# Altium schematic sheet 3Phase Inverter1.SchDoc
size A2
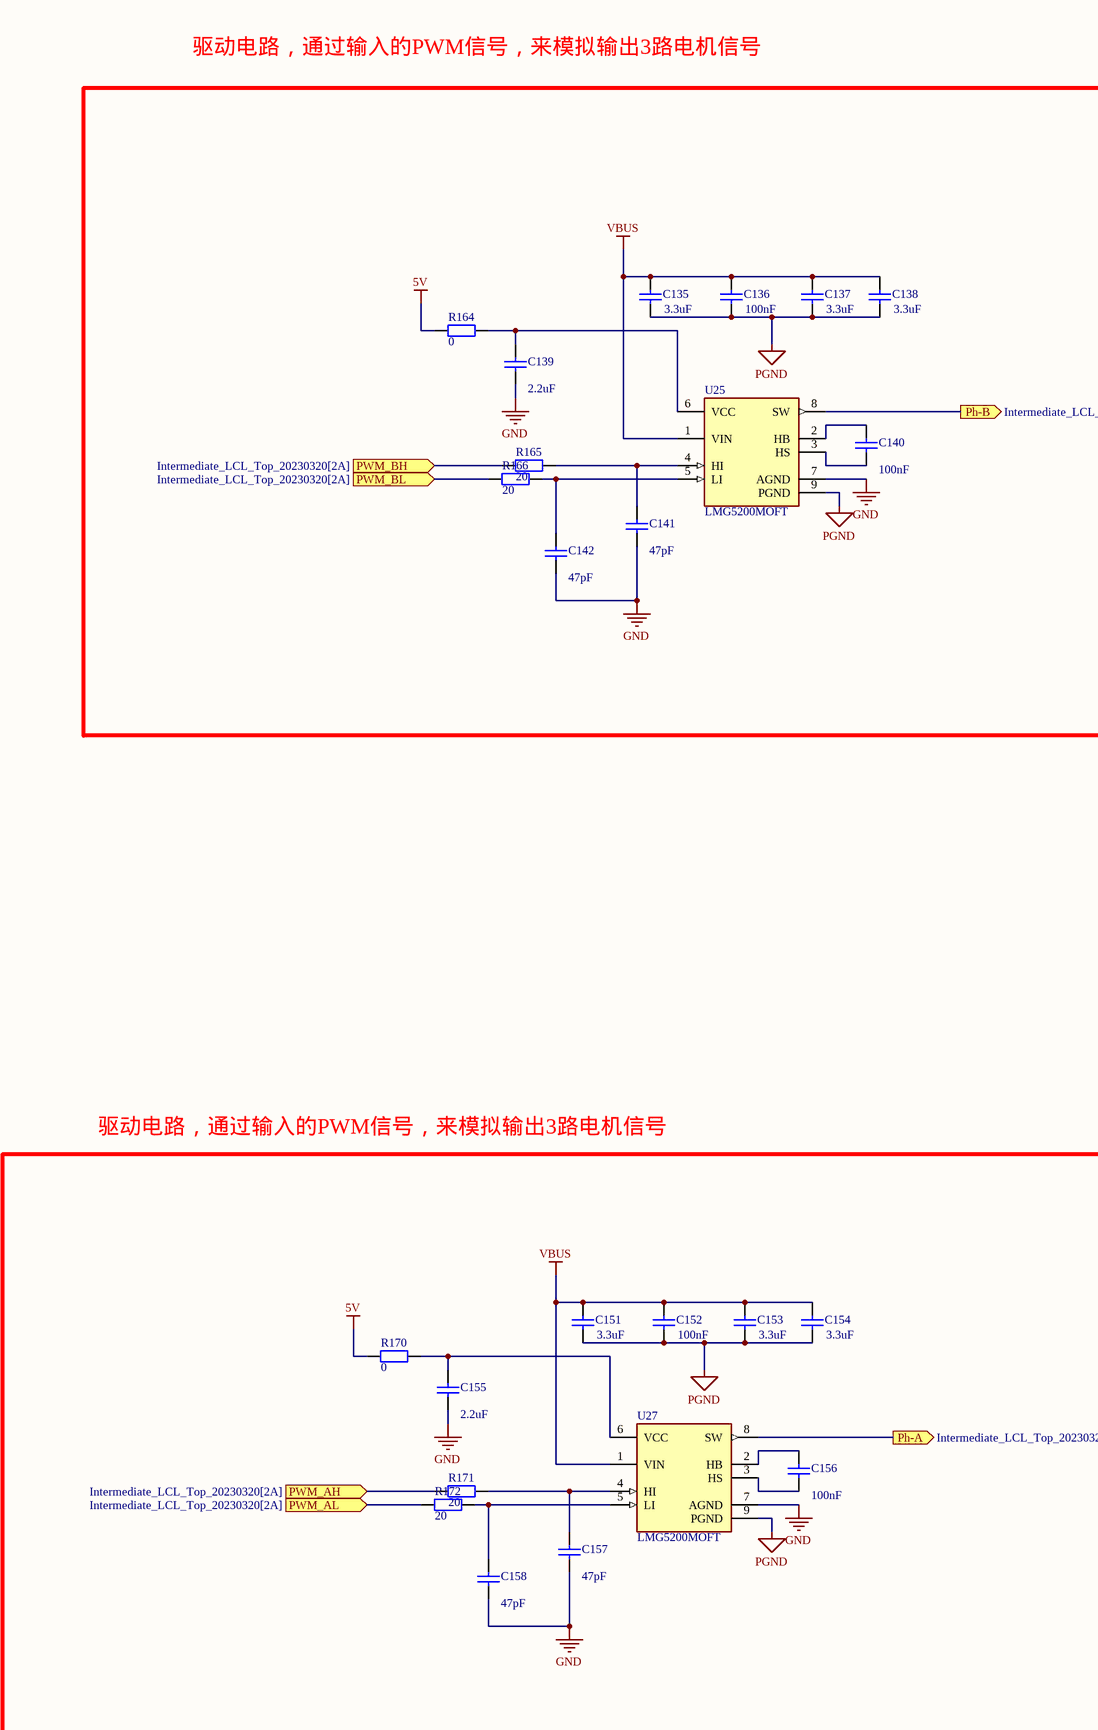
[diagram p0: 3Phase Inverter1.SchDoc, left]
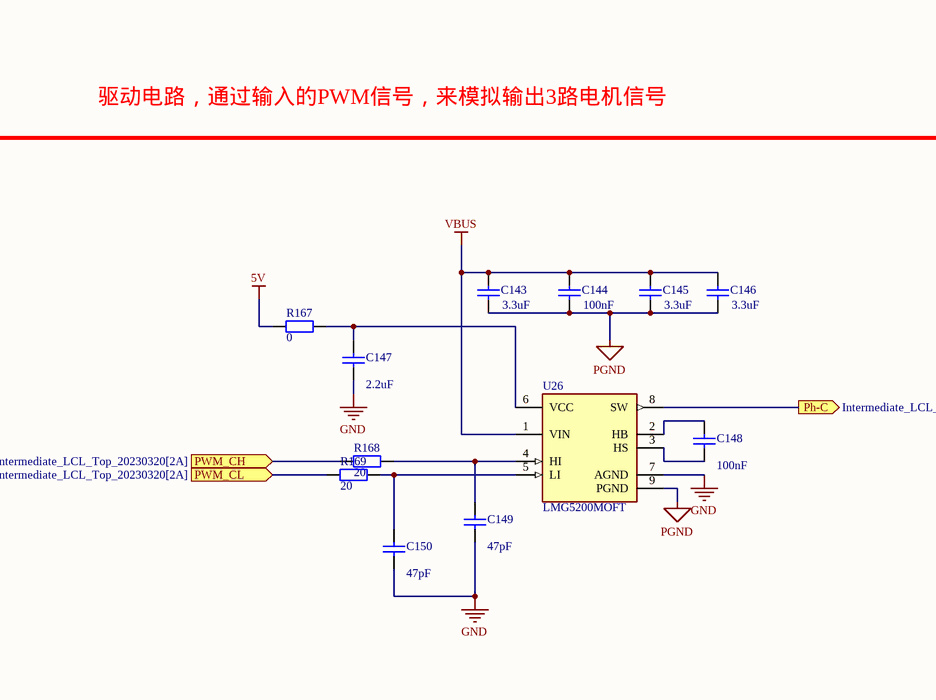
[diagram p1: 3Phase Inverter1.SchDoc, right]

## Parts
C135  3.3uF  [CAPC1608X06N]
C136  100nF  [CAPC1608X06N]
C137  3.3uF  [CAPC1608X06N]
C138  3.3uF  [CAPC1608X06N]
C139  2.2uF  [CAPC1608X06N]
C140  100nF  [CAPC1608X06N]
C141  47pF  [CAPC1608X06N]
C142  47pF  [CAPC1608X06N]
C143  3.3uF  [CAPC1608X06N]
C144  100nF  [CAPC1608X06N]
C145  3.3uF  [CAPC1608X06N]
C146  3.3uF  [CAPC1608X06N]
C147  2.2uF  [CAPC1608X06N]
C148  100nF  [CAPC1608X06N]
C149  47pF  [CAPC1608X06N]
C150  47pF  [CAPC1608X06N]
C151  3.3uF  [CAPC1608X06N]
C152  100nF  [CAPC1608X06N]
C153  3.3uF  [CAPC1608X06N]
C154  3.3uF  [CAPC1608X06N]
C155  2.2uF  [CAPC1608X06N]
C156  100nF  [CAPC1608X06N]
C157  47pF  [CAPC1608X06N]
C158  47pF  [CAPC1608X06N]
R164  0  [RESC1608X05N]
R165  20  [RESC1608X05N]
R166  20  [RESC1608X05N]
R167  0  [RESC1608X05N]
R168  20  [RESC1608X05N]
R169  20  [RESC1608X05N]
R170  0  [RESC1608X05N]
R171  20  [RESC1608X05N]
R172  20  [RESC1608X05N]
U25  LMG5200MOFT  [FP-MOF0009A-MFG]
U26  LMG5200MOFT  [FP-MOF0009A-MFG]
U27  LMG5200MOFT  [FP-MOF0009A-MFG]

## Ports
Ph-A (out, see Intermediate_LCL_Top_20230320[3A], LCL_1[1B]), Ph-B (out, see Intermediate_LCL_Top_20230320[3A], LCL_1[2D]), Ph-C (out, see Intermediate_LCL_Top_20230320[3A], LCL_1[7C]), PWM_AH (in, see Intermediate_LCL_Top_20230320[2A]), PWM_AL (in, see Intermediate_LCL_Top_20230320[2A]), PWM_BH (in, see Intermediate_LCL_Top_20230320[2A]), PWM_BL (in, see Intermediate_LCL_Top_20230320[2A]), PWM_CH (in, see Intermediate_LCL_Top_20230320[2A]), PWM_CL (in, see Intermediate_LCL_Top_20230320[2A])

## Nets
5V: R164.2 R167.2 R170.2
GND: C139.1 C141.2 C142.2 C147.1 C149.2 C150.2 C155.1 C157.2 C158.2 U25.7(AGND) U26.7(AGND) U27.7(AGND)
PGND: C135.1 C136.2 C137.1 C138.1 C143.1 C144.2 C145.1 C146.1 C151.1 C152.2 C153.1 C154.1 U25.9(PGND) U26.9(PGND) U27.9(PGND)
VBUS: C135.2 C136.1 C137.2 C138.2 C143.2 C144.1 C145.2 C146.2 C151.2 C152.1 C153.2 C154.2 U25.1(VIN) U26.1(VIN) U27.1(VIN)
Ph-A: U27.8(SW) ; port Ph-A
Ph-B: U25.8(SW) ; port Ph-B
Ph-C: U26.8(SW) ; port Ph-C
PWM_AH: R171.2 ; port PWM_AH
PWM_AL: R172.2 ; port PWM_AL
PWM_BH: R165.2 ; port PWM_BH
PWM_BL: R166.2 ; port PWM_BL
PWM_CH: R168.2 ; port PWM_CH
PWM_CL: R169.2 ; port PWM_CL
NetC139_2: C139.2 R164.1 U25.6(VCC)
NetC140_1: C140.1 U25.2(HB)
NetC140_2: C140.2 U25.3(HS)
NetC141_1: C141.1 R165.1 U25.4(HI)
NetC142_1: C142.1 R166.1 U25.5(LI)
NetC147_2: C147.2 R167.1 U26.6(VCC)
NetC148_1: C148.1 U26.2(HB)
NetC148_2: C148.2 U26.3(HS)
NetC149_1: C149.1 R168.1 U26.4(HI)
NetC150_1: C150.1 R169.1 U26.5(LI)
NetC155_2: C155.2 R170.1 U27.6(VCC)
NetC156_1: C156.1 U27.2(HB)
NetC156_2: C156.2 U27.3(HS)
NetC157_1: C157.1 R171.1 U27.4(HI)
NetC158_1: C158.1 R172.1 U27.5(LI)

## Notes on the sheet
- 驱动电路，通过输入的PWM信号，来模拟输出3路电机信号

## Library data of the parts
C135-C158 = Cap: Capacitor; Published: 8-Jun-2000; LatestRevisionDate: 17-Jul-2002; LatestRevisionNote: Re-released for DXP Platform.; PackageReference: RAD-0.3; Publisher: Altium Limited; PackageDescription: Radial Cap, Thru-Hole; 2 Leads; 0.3 in Pin Spacing
  C135 C137 C138 C143 C145 C146 C151 C153 C154: Value: 3.3uF
  C136 C140 C144 C148 C152 C156: Value: 100nF
  C139 C147 C155: Value: 2.2uF
  C141 C142 C149 C150 C157 C158: Value: 47pF
R164-R172 = 0603 100KΩ (1003) 1%_4: 贴片电阻; Value: 1MΩ(1%); ComponentLink1Description: 供应商链接; ComponentLink1URL: http://www.szlcsc.com/product/details_26546.html; Package: 0603; Supplier: LC; SuppliersPartNumber: C25803
U25-U27 = CMP-04912-000022-2: None; Output Current per Channel: 10A; Interface: Logic; Min Operating Temperature: -40°C; Mount: Surface Mount; Case/Package: QFN; RoHS Compliant: Yes; Packaging: Cut Tape; Max Operating Temperature: 125°C; Number of Pins: 9